# Altium schematic sheet step-dir.SchDoc
size A4
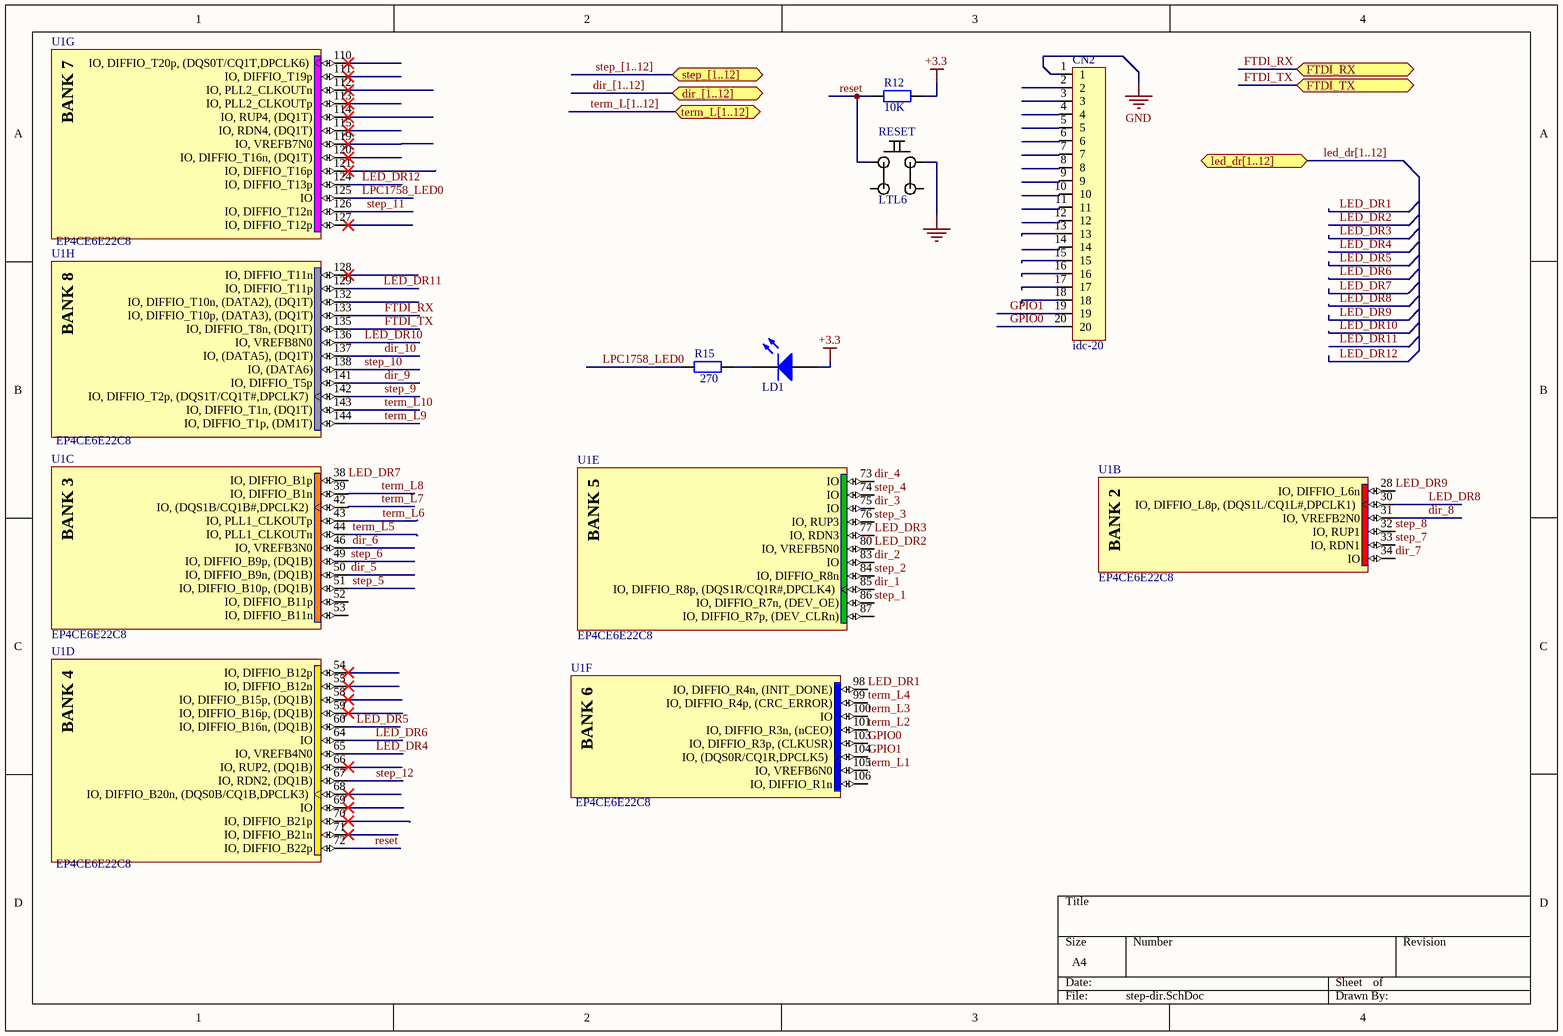
[diagram p0: step-dir.SchDoc]

## Parts
CN2  idc-20  [IDC2.54-V20C]
LD1  chip led  [RESC2012M]  (value not drawn)
R12  value 10K  [RESC2012M]  (hidden comment: Res2)
R15  value 270  [RESC2012M]  (hidden comment: Res2)
RESET  LTL6  [BUTTON - LTL6]
U1  EP4CE6E22C8  [EQFP144_M]  (parts B,C,D,E,F,G,H of 13)

## Ports
dir_[1..12], FTDI_RX, FTDI_TX, led_dr[1..12], step_[1..12], term_L[1..12]

## Nets
+3.3: LD1.1(A) R12.2
GND: CN2.1 RESET.1
dir_1: U1.85(IO,_DIFFIO_R8p,_(DQS1R/CQ1R#,DPCLK4))
dir_2: U1.83(IO)
dir_3: U1.75(IO)
dir_4: U1.73(IO)
dir_5: U1.50(IO,_DIFFIO_B9n,_(DQ1B))
dir_6: U1.46(IO,_VREFB3N0)
dir_7: U1.34(IO)
dir_8: U1.31(IO,_VREFB2N0)
dir_9: U1.141(IO,_DIFFIO_T5p)
dir_10: U1.137(IO,_(DATA5),_(DQ1T))
FTDI_RX: U1.133(IO,_DIFFIO_T10p,_(DATA3),_(DQ1T)) ; port FTDI_RX
FTDI_TX: U1.135(IO,_DIFFIO_T8n,_(DQ1T)) ; port FTDI_TX
GPIO0: CN2.20 U1.103(IO,_DIFFIO_R3p,_(CLKUSR))
GPIO1: CN2.19 U1.104(IO,_(DQS0R/CQ1R,DPCLK5))
LED_DR1: U1.98(IO,_DIFFIO_R4n,_(INIT_DONE))
LED_DR2: U1.80(IO,_VREFB5N0)
LED_DR3: U1.77(IO,_RDN3)
LED_DR4: U1.65(IO,_VREFB4N0)
LED_DR5: U1.60(IO,_DIFFIO_B16n,_(DQ1B))
LED_DR6: U1.64(IO)
LED_DR7: U1.38(IO,_DIFFIO_B1p)
LED_DR8: U1.30(IO,_DIFFIO_L8p,_(DQS1L/CQ1L#,DPCLK1))
LED_DR9: U1.28(IO,_DIFFIO_L6n)
LED_DR10: U1.136(IO,_VREFB8N0)
LED_DR11: U1.129(IO,_DIFFIO_T11p)
LED_DR12: U1.124(IO,_DIFFIO_T13p)
LPC1758_LED0: R15.1 U1.125(IO)
reset: R12.1 RESET.3 U1.72(IO,_DIFFIO_B22p)
step_1: U1.86(IO,_DIFFIO_R7n,_(DEV_OE))
step_2: U1.84(IO,_DIFFIO_R8n)
step_3: U1.76(IO,_RUP3)
step_4: U1.74(IO)
step_5: U1.51(IO,_DIFFIO_B10p,_(DQ1B))
step_6: U1.49(IO,_DIFFIO_B9p,_(DQ1B))
step_7: U1.33(IO,_RDN1)
step_8: U1.32(IO,_RUP1)
step_9: U1.142(IO,_DIFFIO_T2p,_(DQS1T/CQ1T#,DPCLK7))
step_10: U1.138(IO,_(DATA6))
step_11: U1.126(IO,_DIFFIO_T12n)
step_12: U1.67(IO,_RDN2,_(DQ1B))
term_L1: U1.105(IO,_VREFB6N0)
term_L2: U1.101(IO,_DIFFIO_R3n,_(nCEO))
term_L3: U1.100(IO)
term_L4: U1.99(IO,_DIFFIO_R4p,_(CRC_ERROR))
term_L5: U1.44(IO,_PLL1_CLKOUTn)
term_L6: U1.43(IO,_PLL1_CLKOUTp)
term_L7: U1.42(IO,_(DQS1B/CQ1B#,DPCLK2))
term_L8: U1.39(IO,_DIFFIO_B1n)
term_L9: U1.144(IO,_DIFFIO_T1p,_(DM1T))
term_L10: U1.143(IO,_DIFFIO_T1n,_(DQ1T))
NetLD1_2: LD1.2(K) R15.2

Not connected (* = marked no-connect by the designer): CN2 2 3 4 5 6 7 8 9 10 11 12 13 14 15 16 17 18; RESET 2 4; U1 52(IO,_DIFFIO_B11p) 53(IO,_DIFFIO_B11n) 54(IO,_DIFFIO_B12p)* 55(IO,_DIFFIO_B12n)* 58(IO,_DIFFIO_B15p,_(DQ1B))* 59(IO,_DIFFIO_B16p,_(DQ1B))* 66(IO,_RUP2,_(DQ1B))* 68(IO,_DIFFIO_B20n,_(DQS0B/CQ1B,DPCLK3))* 69(IO)* 70(IO,_DIFFIO_B21p)* 71(IO,_DIFFIO_B21n)* 87(IO,_DIFFIO_R7p,_(DEV_CLRn)) 106(IO,_DIFFIO_R1n) 110(IO,_DIFFIO_T20p,_(DQS0T/CQ1T,DPCLK6))* 111(IO,_DIFFIO_T19p)* 112(IO,_PLL2_CLKOUTn)* 113(IO,_PLL2_CLKOUTp)* 114(IO,_RUP4,_(DQ1T))* 115(IO,_RDN4,_(DQ1T))* 119(IO,_VREFB7N0)* 120(IO,_DIFFIO_T16n,_(DQ1T))* 121(IO,_DIFFIO_T16p)* 127(IO,_DIFFIO_T12p)* 128(IO,_DIFFIO_T11n)* 132(IO,_DIFFIO_T10n,_(DATA2),_(DQ1T))

## Buses and harness runs
bus dir_[1..12] = port dir_[1..12]
bus led_dr[1..12] = port led_dr[1..12]
bus step_[1..12] = port step_[1..12]
bus term_L[1..12] = port term_L[1..12]

## Notes on the sheet
- (in symbol EP4CE6E22C8, part B) BANK 2
- (in symbol EP4CE6E22C8, part C) BANK 3
- (in symbol EP4CE6E22C8, part D) BANK 4
- (in symbol EP4CE6E22C8, part E) BANK 5
- (in symbol EP4CE6E22C8, part F) BANK 6
- (in symbol EP4CE6E22C8, part G) BANK 7
- (in symbol EP4CE6E22C8, part H) BANK 8

## Library data of the parts
R12 R15 = Res2: Resistor; Published: 8-Jun-2000; LatestRevisionDate: 17-Jul-2002; LatestRevisionNote: Re-released for DXP Platform.; PackageReference: AXIAL-0.4; Publisher: Altium Limited; PackageDescription: Axial Device, Thru-Hole; 2 Leads; 0.4 in Pin Spacing
RESET = chip button LTL6
U1 = EP4CE6E22C8: Cyclone IV Family FPGA, 2V Core, 91 I/O Pins, 2 PLLs, 144-Pin QFP, Speed Grade 8, Commercial Grade; Published: 3-May-2010; DatasheetVersion: ver1.2, Mar-2010; PackageVersion: ver16.0, Dec-2009; PackageReference: EQFP144; Publisher: Altium Limited; PackageDescription: 144-Pin Plastic Enhanced Quad Flat Pack (EQFP144) - Wire Bond; Supplier 1: Digi-Key; Supplier Part Number 1: EP4CE6E22C8-ND; Code_JEDEC: MS-026-BFB; ComponentLink1Description: Manufacturer Link; ComponentLink1URL: http://www.altera.com/; ComponentLink2Description: Handbook; ComponentLink2URL: http://www.altera.com/literature/hb/cyclone-iv/cyclone4-handbook.pdf; ComponentLink3Description: Pinout Specification; ComponentLink3URL: http://www.altera.com/literature/lit-dp.jsp?category=cyc%204&showspreadsheet=y; ComponentLink4Description: Packaging Specification; ComponentLink4URL: http://www.altera.com/literature/ds/dspkg.pdf